# EasyEDA schematic 1-Schematic_Dot PCB - Dash.json
TITLE: Dot; REV: 1.0; Date: 2020-06-06; Sheet: 1/1; Drawn By: shreyaroxx777; Company: Your Company
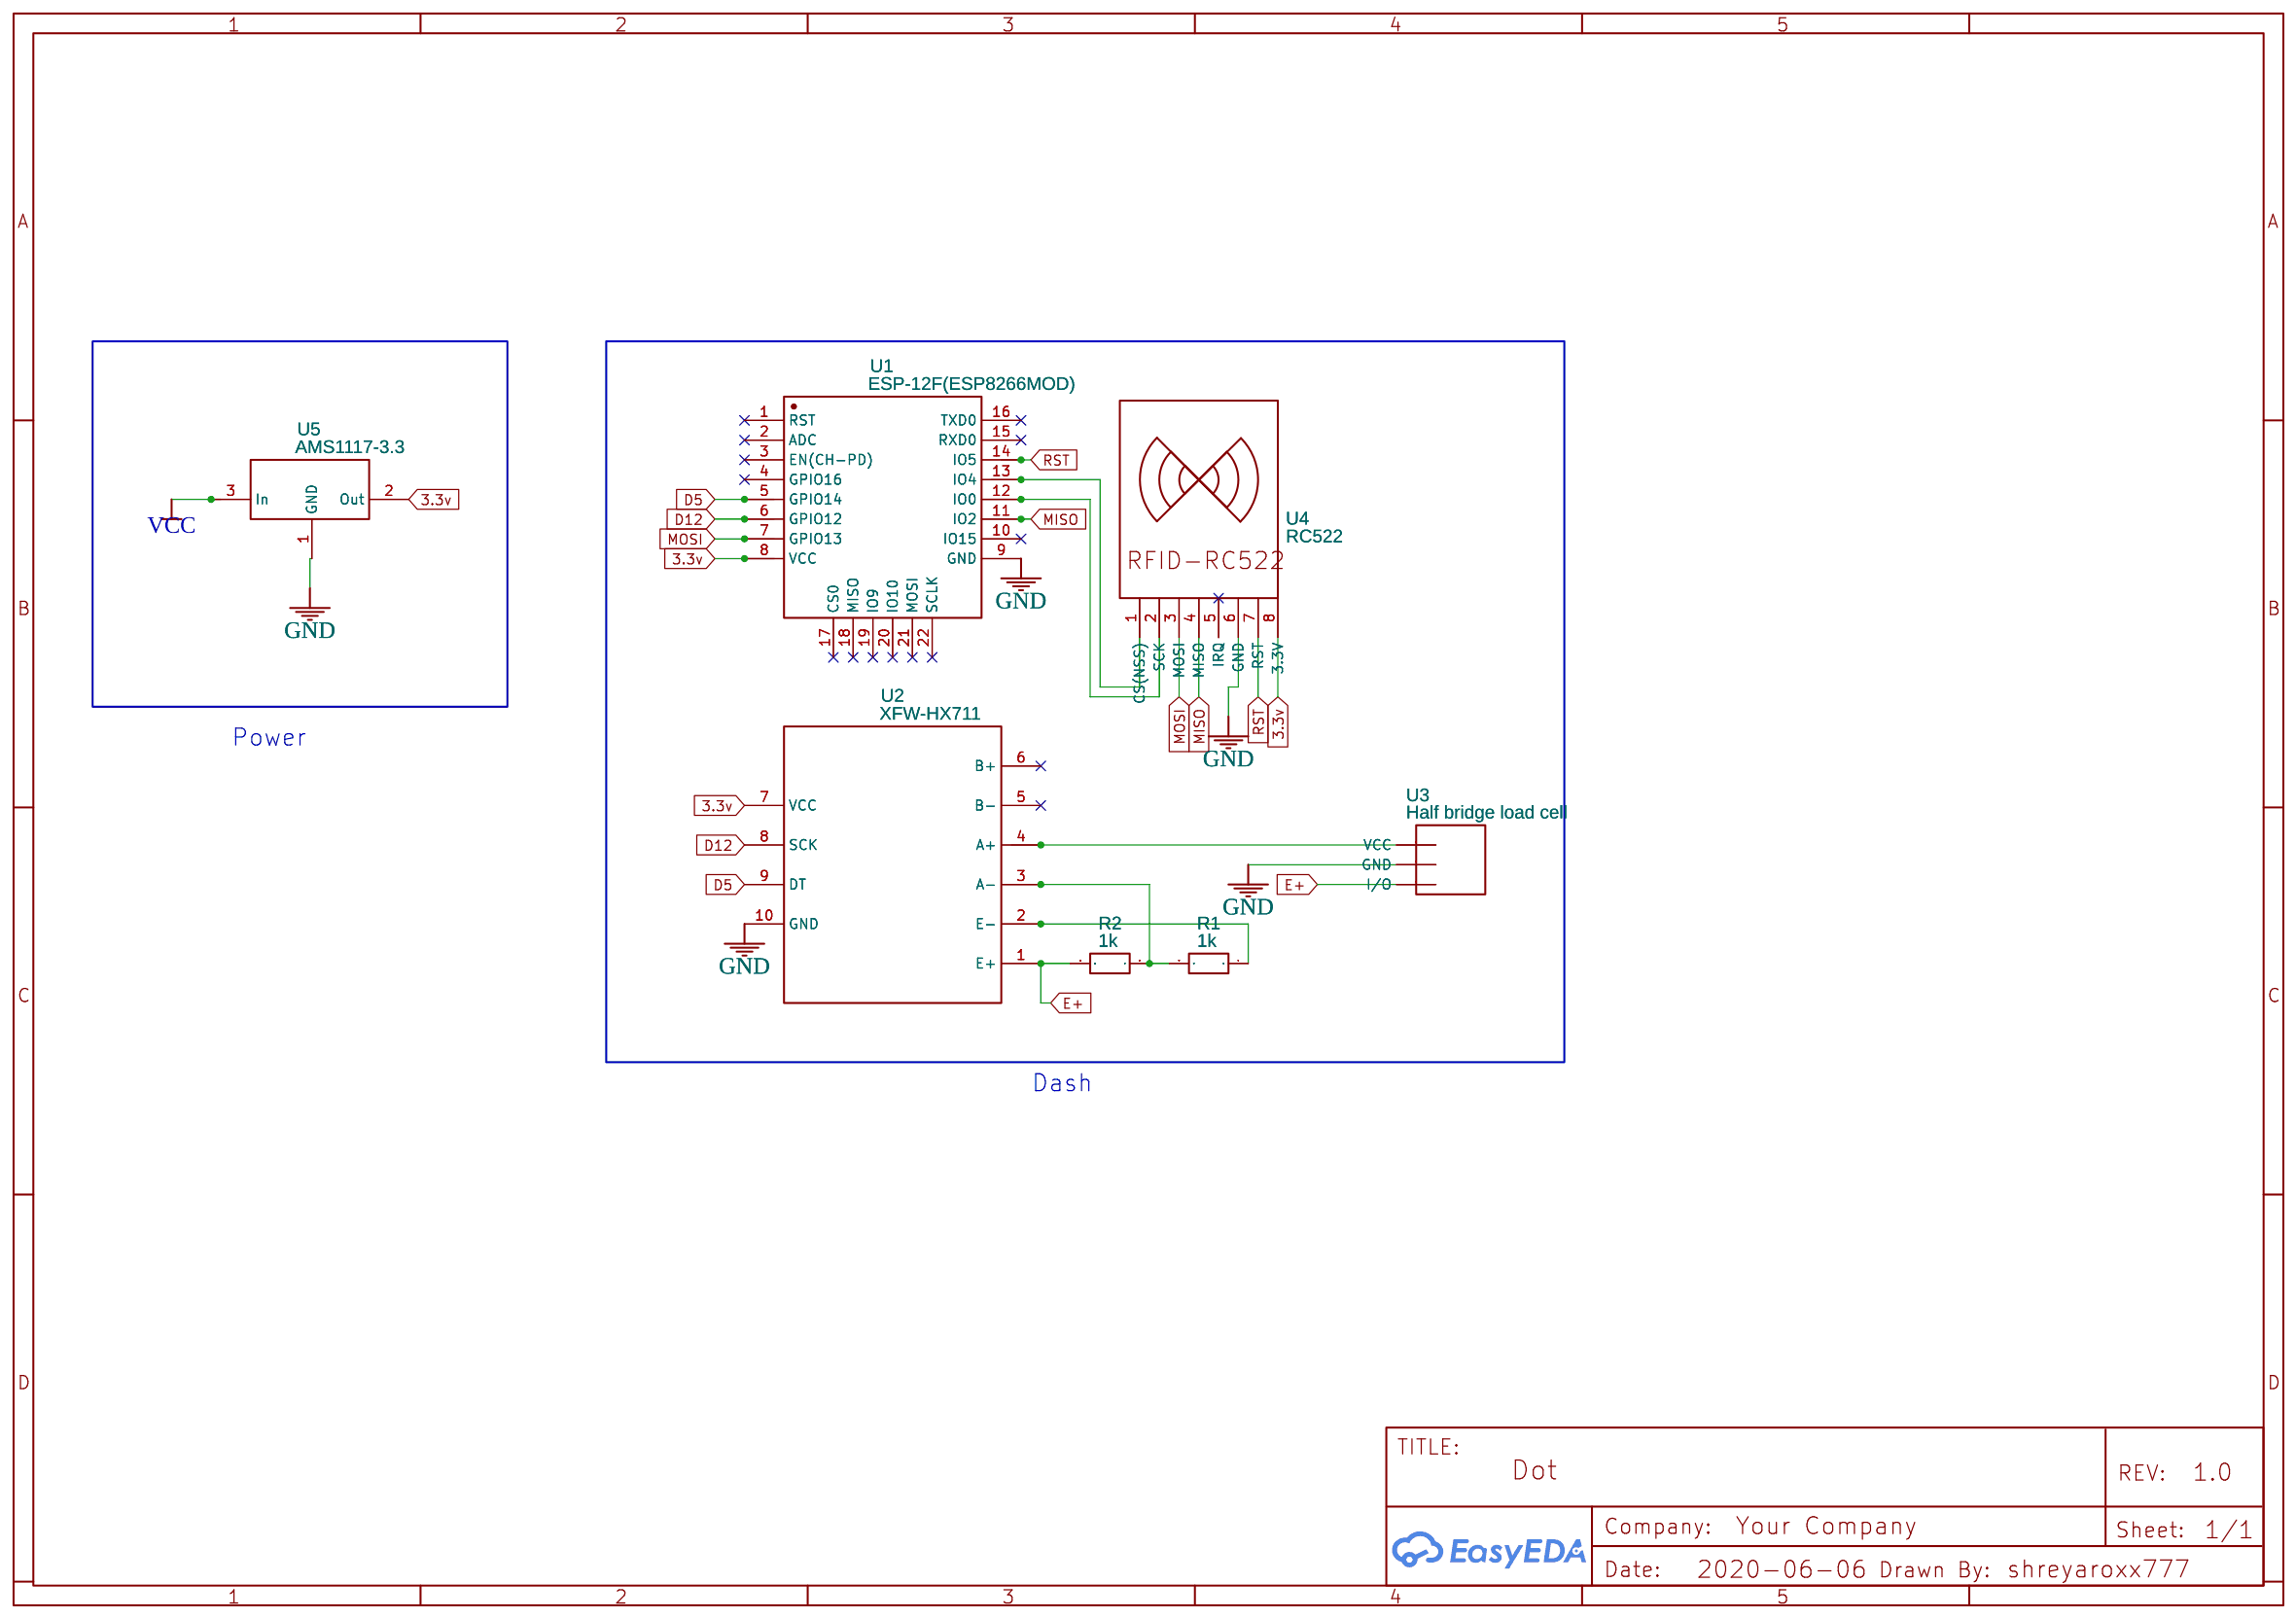
[diagram p0: schematic sheet]

## Parts
R1  1k  [R0201]
R2  1k  [R0201]
U1  ESP-12F(ESP8266MOD)  [WIFIM-SMD_ESP-12F-ESP8266MOD]
U2  XFW-HX711  [XFW-HX711]
U3  Half bridge load cell  [HALF BRIDGE LOAD CELL]
U4  RC522  [RC522 RFID MODULE]
U5  AMS1117-3.3  [AMS_1117]

## Library data of the parts
R1 R2 = R_0201_EU: Contributor: LCEDA_Lib
U1 = ESP-12F(ESP8266MOD): Supplier: LCSC; Manufacturer: Ai-Thinker; Supplier Part: C82891
U2 = XFW-HX711: Contributor: bwp1969
U3 = Half bridge load cell: Contributor: Shreya
U4 = RC522: Contributor: alekseeff
U5 = AMS1117-3.3: sourceId: dwIGgezVh; Supplier Part: C6186; Supplier: LCSC; Manufacturer: AMS; LCSC Assembly: Yes; SMT Type: Basic

## Nets
3.3v: U1.8(VCC) U2.7(VCC) U4.8(3.3V) U5.2(Out)
GND: U1.9(GND) U2.10(GND) U3.2(GND) U4.6(GND) U5.1(GND)
VCC: U5.3(In)
D5: U1.5(GPIO14) U2.9(DT)
D12: U1.6(GPIO12) U2.8(SCK)
E+: R2.2 U2.1(E+) U3.3(I/O)
MISO: U1.11(IO2) U4.4(MISO)
MOSI: U1.7(GPIO13) U4.3(MOSI)
RST: U1.14(IO5) U4.7(RST)
Net-(R1-1): R1.1 U2.2(E-)
Net-(R1-2): R1.2 R2.1 U2.3(A-)
Net-(U1-12): U1.12(IO0) U4.2(SCK)
Net-(U1-13): U1.13(IO4) U4.1(CS(NSS))
Net-(U2-4): U2.4(A+) U3.1(VCC)

Not connected (* = marked no-connect by the designer): U1 1(RST)* 2(ADC)* 3(EN(CH-PD))* 4(GPIO16)* 10(IO15)* 15(RXD0)* 16(TXD0)* 17(CS0)* 18(MISO)* 19(IO9)* 20(IO10)* 21(MOSI)* 22(SCLK)*; U2 5(B-)* 6(B+)*; U4 5(IRQ)*

## Notes on the sheet
- Power
- Dash
